# Altium schematic sheet MCU.SchDoc: Gimbal MCU Schematic
size Letter; DrawnBy: Jing Hao Yao; Organization: UW Robotics; Address1: 200 University Avenue; Address2: Waterloo; Address3: Ontario; Address4: Canada N2L 3G6; SheetNumber: 1; SheetTotal: 5
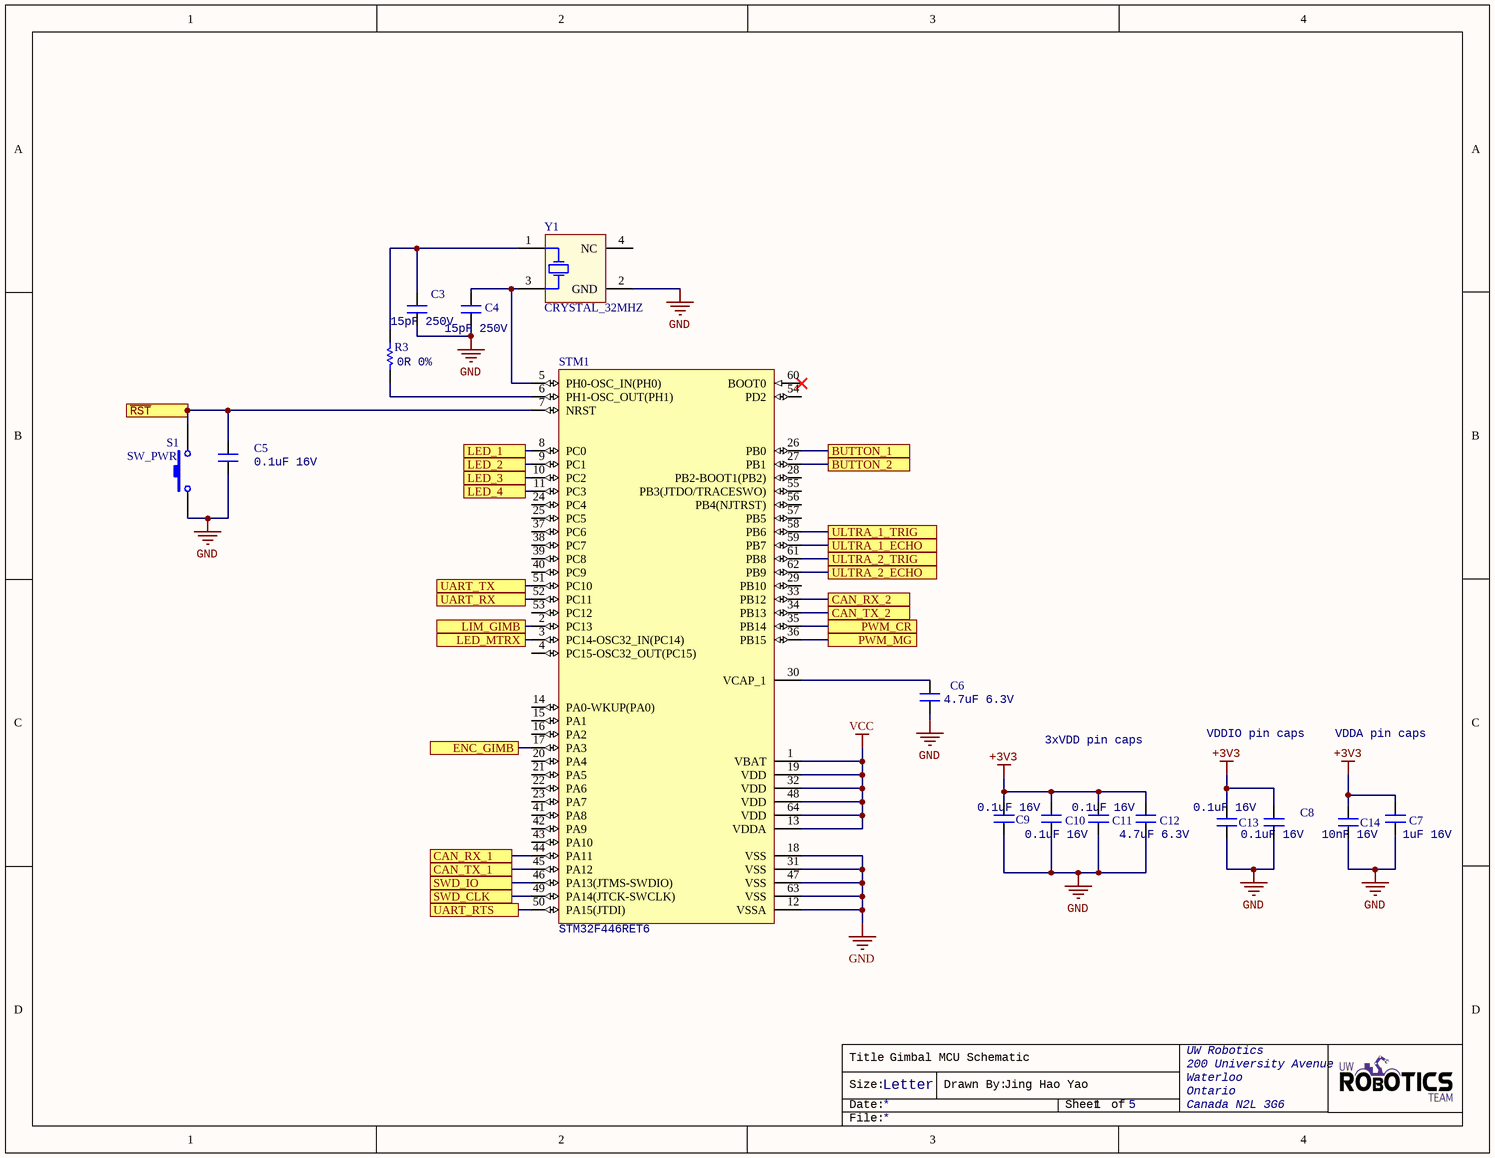
[diagram p0: MCU.SchDoc]

## Parts
C3  value 15pF 250V  [CAPC0603(1608)55_N]  (hidden comment: CAP_15pF_0603)
C4  value 15pF 250V  [CAPC0603(1608)55_N]  (hidden comment: CAP_15pF_0603)
C5  value 0.1uF 16V  [CAPC0603(1608)55_N]  (hidden comment: CAP_0.1uF_16V_0603)
C6  value 4.7uF 6.3V  [CAPC0603(1608)55_N]  (hidden comment: CAP_4.7uF_0603)
C7  value 1uF 16V  [CAPC0603(1608)55_N]  (hidden comment: CAP_1uF_16V_0603)
C8  value 0.1uF 16V  [CAPC0603(1608)55_N]  (hidden comment: CAP_0.1uF_16V_0603)
C9  value 0.1uF 16V  [CAPC0603(1608)55_N]  (hidden comment: CAP_0.1uF_16V_0603)
C10  value 0.1uF 16V  [CAPC0603(1608)55_N]  (hidden comment: CAP_0.1uF_16V_0603)
C11  value 0.1uF 16V  [CAPC0603(1608)55_N]  (hidden comment: CAP_0.1uF_16V_0603)
C12  value 4.7uF 6.3V  [CAPC0603(1608)55_N]  (hidden comment: CAP_4.7uF_0603)
C13  value 0.1uF 16V  [CAPC0603(1608)55_N]  (hidden comment: CAP_0.1uF_16V_0603)
C14  value 10nF 16V  [CAPC0603(1608)55_N]  (hidden comment: CAP_10nF_0603)
R3  value 0R 0%  [RESC0603(1608)_N]  (hidden comment: RES_0R_0603)
S1  SW_PWR  [PTS830GM140]
STM1  STM32F446RET6  [STM-LQFP64_L]
Y1  CRYSTAL_32MHZ  [AVX-CX2520DB32000D0GEJZ1-4_V]

## Ports
BUTTON_1, BUTTON_2, CAN_RX_1, CAN_RX_2, CAN_TX_1, CAN_TX_2, ENC_GIMB, LED_1, LED_2, LED_3, LED_4, LED_MTRX, LIM_GIMB, PWM_CR, PWM_MG, SWD_CLK, SWD_IO, UART_RTS, UART_RX, UART_TX, ULTRA_1_ECHO, ULTRA_1_TRIG, ULTRA_2_ECHO, ULTRA_2_TRIG, ~{RST} (in)

## Nets
+3V3: C7.2 C8.2 C9.2 C10.2 C11.2 C12.2 C13.2 C14.2
GND: C3.1 C4.1 C5.1 C6.1 C7.1 C8.1 C9.1 C10.1 C11.1 C12.1 C13.1 C14.1 S1.1 STM1.12(VSSA) STM1.18(VSS) STM1.31(VSS) STM1.47(VSS) STM1.63(VSS) Y1.2(GND)
VCC: STM1.1(VBAT) STM1.13(VDDA) STM1.19(VDD) STM1.32(VDD) STM1.48(VDD) STM1.64(VDD)
~{RST}: C5.2 S1.2 STM1.7(NRST) ; port ~{RST}
BUTTON_1: STM1.26(PB0) ; port BUTTON_1
BUTTON_2: STM1.27(PB1) ; port BUTTON_2
CAN_RX_1: STM1.44(PA11) ; port CAN_RX_1
CAN_RX_2: STM1.33(PB12) ; port CAN_RX_2
CAN_TX_1: STM1.45(PA12) ; port CAN_TX_1
CAN_TX_2: STM1.34(PB13) ; port CAN_TX_2
ENC_GIMB: STM1.17(PA3) ; port ENC_GIMB
LED_1: STM1.8(PC0) ; port LED_1
LED_2: STM1.9(PC1) ; port LED_2
LED_3: STM1.10(PC2) ; port LED_3
LED_4: STM1.11(PC3) ; port LED_4
LED_MTRX: STM1.3(PC14-OSC32_IN(PC14)) ; port LED_MTRX
LIM_GIMB: STM1.2(PC13) ; port LIM_GIMB
PWM_CR: STM1.35(PB14) ; port PWM_CR
PWM_MG: STM1.36(PB15) ; port PWM_MG
SWD_CLK: STM1.49(PA14(JTCK-SWCLK)) ; port SWD_CLK
SWD_IO: STM1.46(PA13(JTMS-SWDIO)) ; port SWD_IO
UART_RTS: STM1.50(PA15(JTDI)) ; port UART_RTS
UART_RX: STM1.52(PC11) ; port UART_RX
UART_TX: STM1.51(PC10) ; port UART_TX
ULTRA_1_ECHO: STM1.59(PB7) ; port ULTRA_1_ECHO
ULTRA_1_TRIG: STM1.58(PB6) ; port ULTRA_1_TRIG
ULTRA_2_ECHO: STM1.62(PB9) ; port ULTRA_2_ECHO
ULTRA_2_TRIG: STM1.61(PB8) ; port ULTRA_2_TRIG
NetC3_2: C3.2 R3.2 Y1.1(HOT)
NetC4_2: C4.2 STM1.5(PH0-OSC_IN(PH0)) Y1.3(HOT)
NetC6_2: C6.2 STM1.30(VCAP_1)
NetR3_1: R3.1 STM1.6(PH1-OSC_OUT(PH1))

Not connected (* = marked no-connect by the designer): STM1 4(PC15-OSC32_OUT(PC15)) 14(PA0-WKUP(PA0)) 15(PA1) 16(PA2) 20(PA4) 21(PA5) 22(PA6) 23(PA7) 24(PC4) 25(PC5) 28(PB2-BOOT1(PB2)) 29(PB10) 37(PC6) 38(PC7) 39(PC8) 40(PC9) 41(PA8) 42(PA9) 43(PA10) 53(PC12) 54(PD2) 55(PB3(JTDO/TRACESWO)) 56(PB4(NJTRST)) 57(PB5) 60(BOOT0)*; Y1 4(NC)

## Notes on the sheet
- 3xVDD pin caps
- VDDIO pin caps
- VDDA pin caps
- Title
- Size:
- Date:
- Letter
- Drawn By:
- Sheet
- of
- File:

## Library data of the parts
C3 C4 = CAP_15pF_0603: CAP CER 15PF 250V NPO 0603; Manufacturer: Yageo; MPN: AC0603JRNPOYBN150; Temperature Coefficient: NP0; Dimensions: 0.063" L x 0.031" W (1.60mm x 0.80mm); Package: 0603 (1608 Metric); Voltage Rating: 250v; Digikey Part Number: 311-3282-1-ND
C5 C8-C11 C13 = CAP_0.1uF_16V_0603: CAP CER 0.1UF 16V X7R 0603; Manufacturer: Yageo; MPN: CC0603KRX7R7BB104; Dimensions: 0.063" L x 0.031" W (1.60mm x 0.80mm); Package: 0603 (1608 Metric); Temperature Coefficient: X7R; Voltage Rating: 16V; Digikey Part Number: 311-1088-1-ND
C6 C12 = CAP_4.7uF_0603: CAP CER 4.7UF 6.3V X5R 0603; Manufacturer: Yageo; MPN: CC0603KRX5R5BB475; Dimensions: 0.063" L x 0.031" W (1.60mm x 0.80mm); Package: 0603 (1608 Metric); Temperature Coefficient: X5R; Voltage Rating: 6.3V; Digikey Part Number: 311-1521-1-ND
C7 = CAP_1uF_16V_0603: CAP CER 1UF 16V Y5V 0603; Manufacturer: Yageo; MPN: CC0603ZRY5V7BB105; Dimensions: 0.063" L x 0.031" W (1.60mm x 0.80mm); Package: 0603 (1608 Metric); Temperature Coefficient: Y5V; Voltage Rating: 16V; Digikey Part Number: 311-1372-1-ND
C14 = CAP_10nF_0603: CAP CER 10000PF 16V X7R 0603; Manufacturer: Yageo; MPN: CC0603KRX7R7BB103; Dimensions: 0.063" L x 0.031" W (1.60mm x 0.80mm); Package: 0603 (1608 Metric); Temperature Coefficient: X7R; Voltage Rating: 16V; Digikey Part Number: 311-3369-1-ND
R3 = RES_0R_0603: RES SMD 0 OHM JUMPER 1/10W 0603; Manufacturer: Yageo; MPN: RC0603JR-070RL; Package: 0603 (1608 Metric); Dimensions: 0.063" L x 0.031" W (1.60mm x 0.80mm); Digikey Part Number: 311-0.0GRCT-ND
S1 = SW_PWR: Power Switch (Red); pin to pad: 2>4; MPN: PTS830GM140 SMTR LFS; Manufacturer: C&K; ComponentLink1Description: Datasheet; ComponentLink1URL: https://www.ckswitches.com/media/1478/pts830.pdf; Digikey Part Number: CKN10587CT-ND
STM1 = MCU_STM32F446RET6: ARM Cortex-M4 32-bit MCU+FPU, 512 KB Flash, 128 KB Internal RAM, 50 I/Os, 64-Pin LQFP, -40 to 85 degC, Tray; I/Os (High Current): 50; Supply Voltage(Vcc) min (V): 1.7; Operating Frequency(F) (Processor speed) (MHz): 180; D/A Converter: 2; Internal RAM Size (kB): 128; FLASH Size (Prog) (kB): 512; Core: ARM Cortex-M4; ComponentLink1Description: Manufacturer URL; Package Reference: 64-Pin Low-profile Quad Flat Package, Body 10 x 10 mm, Pitch 0.5 mm; ComponentLink2URL: http://www.st.com/st-web-ui/static/active/en/resource/technical/document/datasheet/DM00141306.pdf; Packing: Tray; DatasheetVersion: Rev. 6; ComponentLink1URL: http://www.st.com/; ComponentLink2Description: Datasheet; Package Description: LQFP64; Mounting Technology: Surface Mount
Y1 = CRYSTAL_32MHZ: CRYSTAL 32MHZ 8PF SMD; Manufacturer: Kyocera International Inc. Electronic Components; MPN: CX2520DB32000D0GPSC1; Package: 4-SMD, No Lead; Dimensions: 0.098" L x 0.079" W (2.50mm x 2.00mm); Digikey Part Number: 1253-1730-1-ND